# EAGLE schematic LinTempCont_4ch_V1_1 (EAGLE 6.5.0)

## Sheet 1 of 5: Digital and DAC
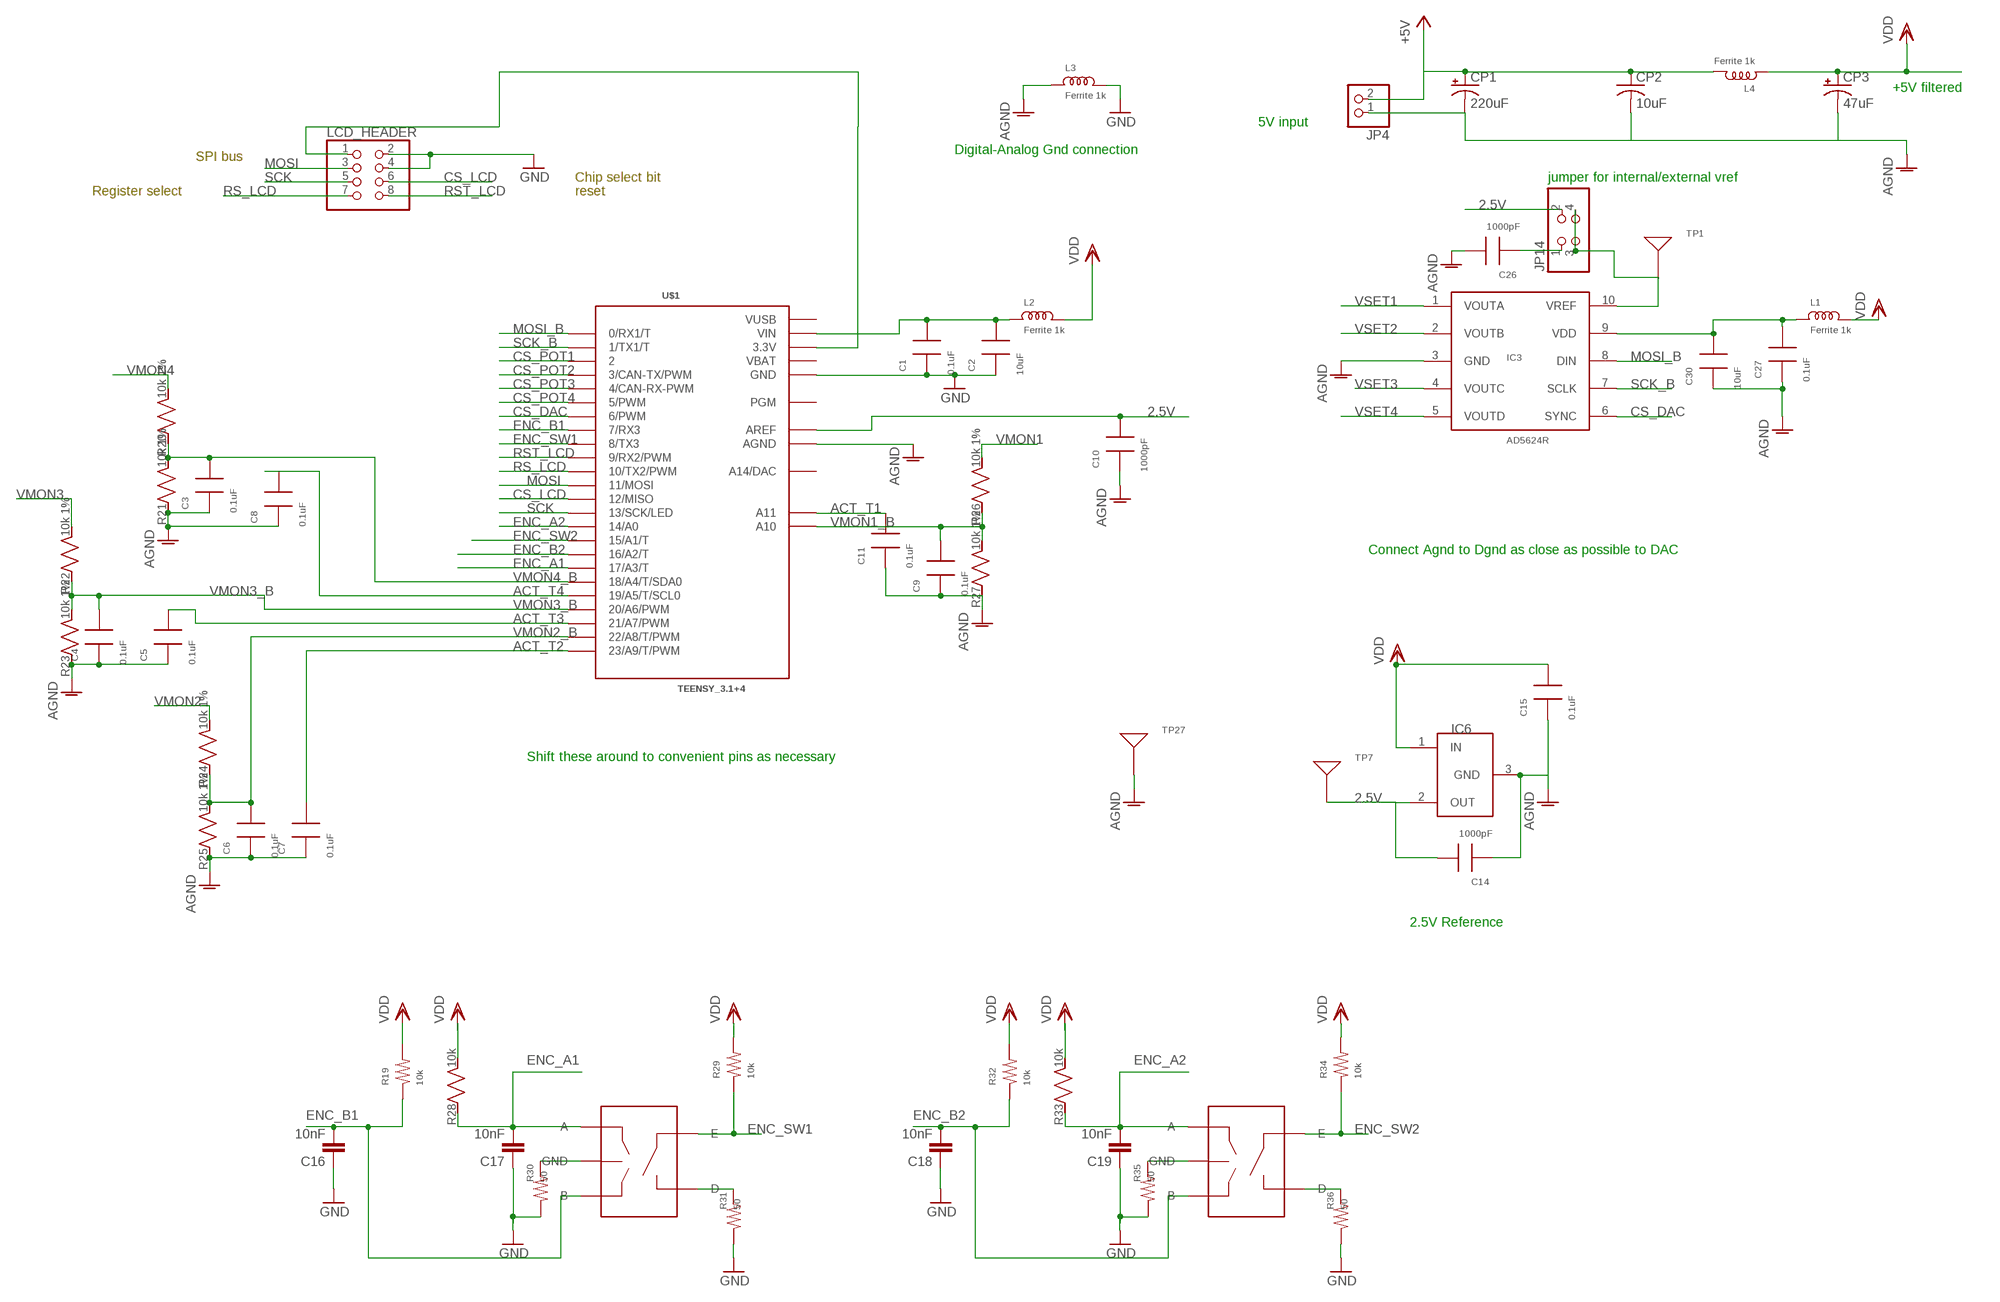
[diagram p0: schematic, sheet 1]

### Parts
C1  0.1uF  CAP0603  [0603]
C2  10uF  CAP0805  [0805]
C3  0.1uF  CAP0603  [0603]
C4  0.1uF  CAP0603  [0603]
C5  0.1uF  CAP0603  [0603]
C6  0.1uF  CAP0603  [0603]
C7  0.1uF  CAP0603  [0603]
C8  0.1uF  CAP0603  [0603]
C9  0.1uF  CAP0603  [0603]
C10  1000pF  CAP0603  [0603]
C11  0.1uF  CAP0603  [0603]
C14  1000pF  CAP0603  [0603]
C15  0.1uF  CAP0603  [0603]
C16  10nF  C-EUC0603  [C0603]
C17  10nF  C-EUC0603  [C0603]
C18  10nF  C-EUC0603  [C0603]
C19  10nF  C-EUC0603  [C0603]
C26  1000pF  CAP0603  [0603]
C27  0.1uF  CAP0603  [0603]
C30  10uF  CAP0805  [0805]
CP1  220uF  CPOL-USF  [PANASONIC_F]
CP2  10uF  C-USC0805K  [C0805K]
CP3  47uF  CPOL-USCT7343  [CT7343]
ENC1  PEC09  [PEC092320FS]
ENC2  PEC09  [PEC092320FS]
IC3  AD5624R  [MSOP10]
IC6  TS6001  [SOT-23]
JP4  SCRWTRM-1X2  [1X02_SCRWTRM]
JP14  PINHD-2X2  [2X02]
L1  Ferrite 1k  INDUCTOR-0805  [0805]
L2  Ferrite 1k  INDUCTOR-0805  [0805]
L3  Ferrite 1k  INDUCTOR-0805  [0805]
L4  Ferrite 1k  INDUCTOR-0805  [0805]
LCD_HEADER  PINHD-2X4-SHROUD  [ML08]
R19  10k  RES0603  [0603]
R20  10k 1%  R_SMDR0603  [R_0603]
R21  10k 1%  R_SMDR0603  [R_0603]
R22  10k 1%  R_SMDR0603  [R_0603]
R23  10k 1%  R_SMDR0603  [R_0603]
R24  10k 1%  R_SMDR0603  [R_0603]
R25  10k 1%  R_SMDR0603  [R_0603]
R26  10k 1%  R_SMDR0603  [R_0603]
R27  10k 1%  R_SMDR0603  [R_0603]
R28  10k  R_SMDR0603  [R_0603]
R29  10k  RES0603  [0603]
R30  50  RES0603  [0603]
R31  50  RES0603  [0603]
R32  10k  RES0603  [0603]
R33  10k  R_SMDR0603  [R_0603]
R34  10k  RES0603  [0603]
R35  50  RES0603  [0603]
R36  50  RES0603  [0603]
TP1  TESTPT  [1206TESTPAD]
TP7  TESTPT  [1206TESTPAD]
TP27  TESTPT  [1206TESTPAD]
U$1  TEENSY_3.1+4  [TEENSY_3.1+4]

### Nets
2.5V: C10.2 C14.2 IC6.2(OUT) JP14.2 TP7.P$1 U$1.AREF ; also sheet 2,3,4,5
3.3V: LCD_HEADER.1 U$1.3.3V U$1.3.3V1(3.3V)
+5V: CP1.+ CP2.1 JP4.2 L4.2
ACT_T1: C11.2 U$1.A11 ; also sheet 2
ACT_T2: C7.2 U$1.23/A9(23/A9/T/PWM) ; also sheet 3
ACT_T3: C5.2 U$1.21/A7(21/A7/PWM) ; also sheet 4
ACT_T4: C8.2 U$1.19/A5(19/A5/T/SCL0) ; also sheet 5
AGND: C3.1 C4.1 C5.1 C6.1 C7.1 C8.1 C9.1 C10.1 C11.1 C14.1 C15.1 C26.2 C27.1 C30.1 CP1.- CP2.2 CP3.- IC3.3(GND) IC6.3(GND) JP4.1 L3.1 R21.P$1 R23.P$1 R25.P$1 R27.P$1 TP27.P$1 U$1.AGND ; also sheet 2,3,4,5
CS_DAC: IC3.6(SYNC) U$1.6(6/PWM)
CS_LCD: LCD_HEADER.6 U$1.12(12/MISO)
CS_POT1: U$1.2 ; also sheet 2
CS_POT2: U$1.3(3/CAN-TX/PWM) ; also sheet 3
CS_POT3: U$1.4(4/CAN-RX-PWM) ; also sheet 4
CS_POT4: U$1.5(5/PWM) ; also sheet 5
DGND: C1.1 C2.1 C16.1 C17.1 C18.1 C19.1 L3.2 LCD_HEADER.2 LCD_HEADER.4 R30.1 R31.1 R35.1 R36.1 U$1.GND U$1.GND1(GND) ; supply symbol labelled GND ; also sheet 2,3,4,5
ENC_A1: C17.2 ENC1.A R28.P$1 U$1.17/A3(17/A3/T)
ENC_A2: C19.2 ENC2.A R33.P$1 U$1.14/A0
ENC_B1: C16.2 ENC1.B R19.1 U$1.7(7/RX3)
ENC_B2: C18.2 ENC2.B R32.1 U$1.16/A2(16/A2/T)
ENC_SW1: ENC1.E R29.1 U$1.8(8/TX3)
ENC_SW2: ENC2.E R34.1 U$1.15/A1(15/A1/T)
MOSI: LCD_HEADER.3 U$1.11(11/MOSI)
MOSI_B: IC3.8(DIN) U$1.0(0/RX1/T) ; also sheet 2,3,4,5
N$1: IC3.10(VREF) JP14.3 JP14.4 TP1.P$1
N$15: ENC1.C(GND) R30.2
N$16: ENC1.D R31.2
N$17: ENC2.C(GND) R35.2
N$18: C26.1 JP14.1
N$19: ENC2.D R36.2
N$24: C27.2 C30.2 IC3.9(VDD) L1.1
N$25: C1.2 C2.2 L2.1 U$1.VIN
RS_LCD: LCD_HEADER.7 U$1.10(10/TX2/PWM)
RST_LCD: LCD_HEADER.8 U$1.9(9/RX2/PWM)
SCK: LCD_HEADER.5 U$1.13(13/SCK/LED)
SCK_B: IC3.7(SCLK) U$1.1(1/TX1/T) ; also sheet 2,3,4,5
VDD: C15.2 CP3.+ IC6.1(IN) L1.2 L2.2 L4.1 R19.2 R28.P$2 R29.2 R32.2 R33.P$2 R34.2 ; also sheet 2,3,4,5
VMON1: R26.P$2 ; also sheet 2
VMON1_B: C9.2 R26.P$1 R27.P$2 U$1.A10
VMON2: R24.P$2 ; also sheet 3
VMON2_B: C6.2 R24.P$1 R25.P$2 U$1.22/A8(22/A8/T/PWM)
VMON3: R22.P$2 ; also sheet 4
VMON3_B: C4.2 R22.P$1 R23.P$2 U$1.20/A6(20/A6/PWM)
VMON4: R20.P$2 ; also sheet 5
VMON4_B: C3.2 R20.P$1 R21.P$2 U$1.18/A4(18/A4/T/SDA0)
VSET1: IC3.1(VOUTA) ; also sheet 2
VSET2: IC3.2(VOUTB) ; also sheet 3
VSET3: IC3.4(VOUTC) ; also sheet 4
VSET4: IC3.5(VOUTD) ; also sheet 5
Unconnected: U$1.A14(A14/DAC) U$1.PGM

### Notes on the sheet
- +5V filtered
- 5V input
- Digital-Analog Gnd connection
- SPI bus
- Chip select bit | jumper for internal/external vref
- Register select | reset
- Connect Agnd to Dgnd as close as possible to DAC
- Shift these around to convenient pins as necessary
- 2.5V Reference

## Sheet 2 of 5: Ch1
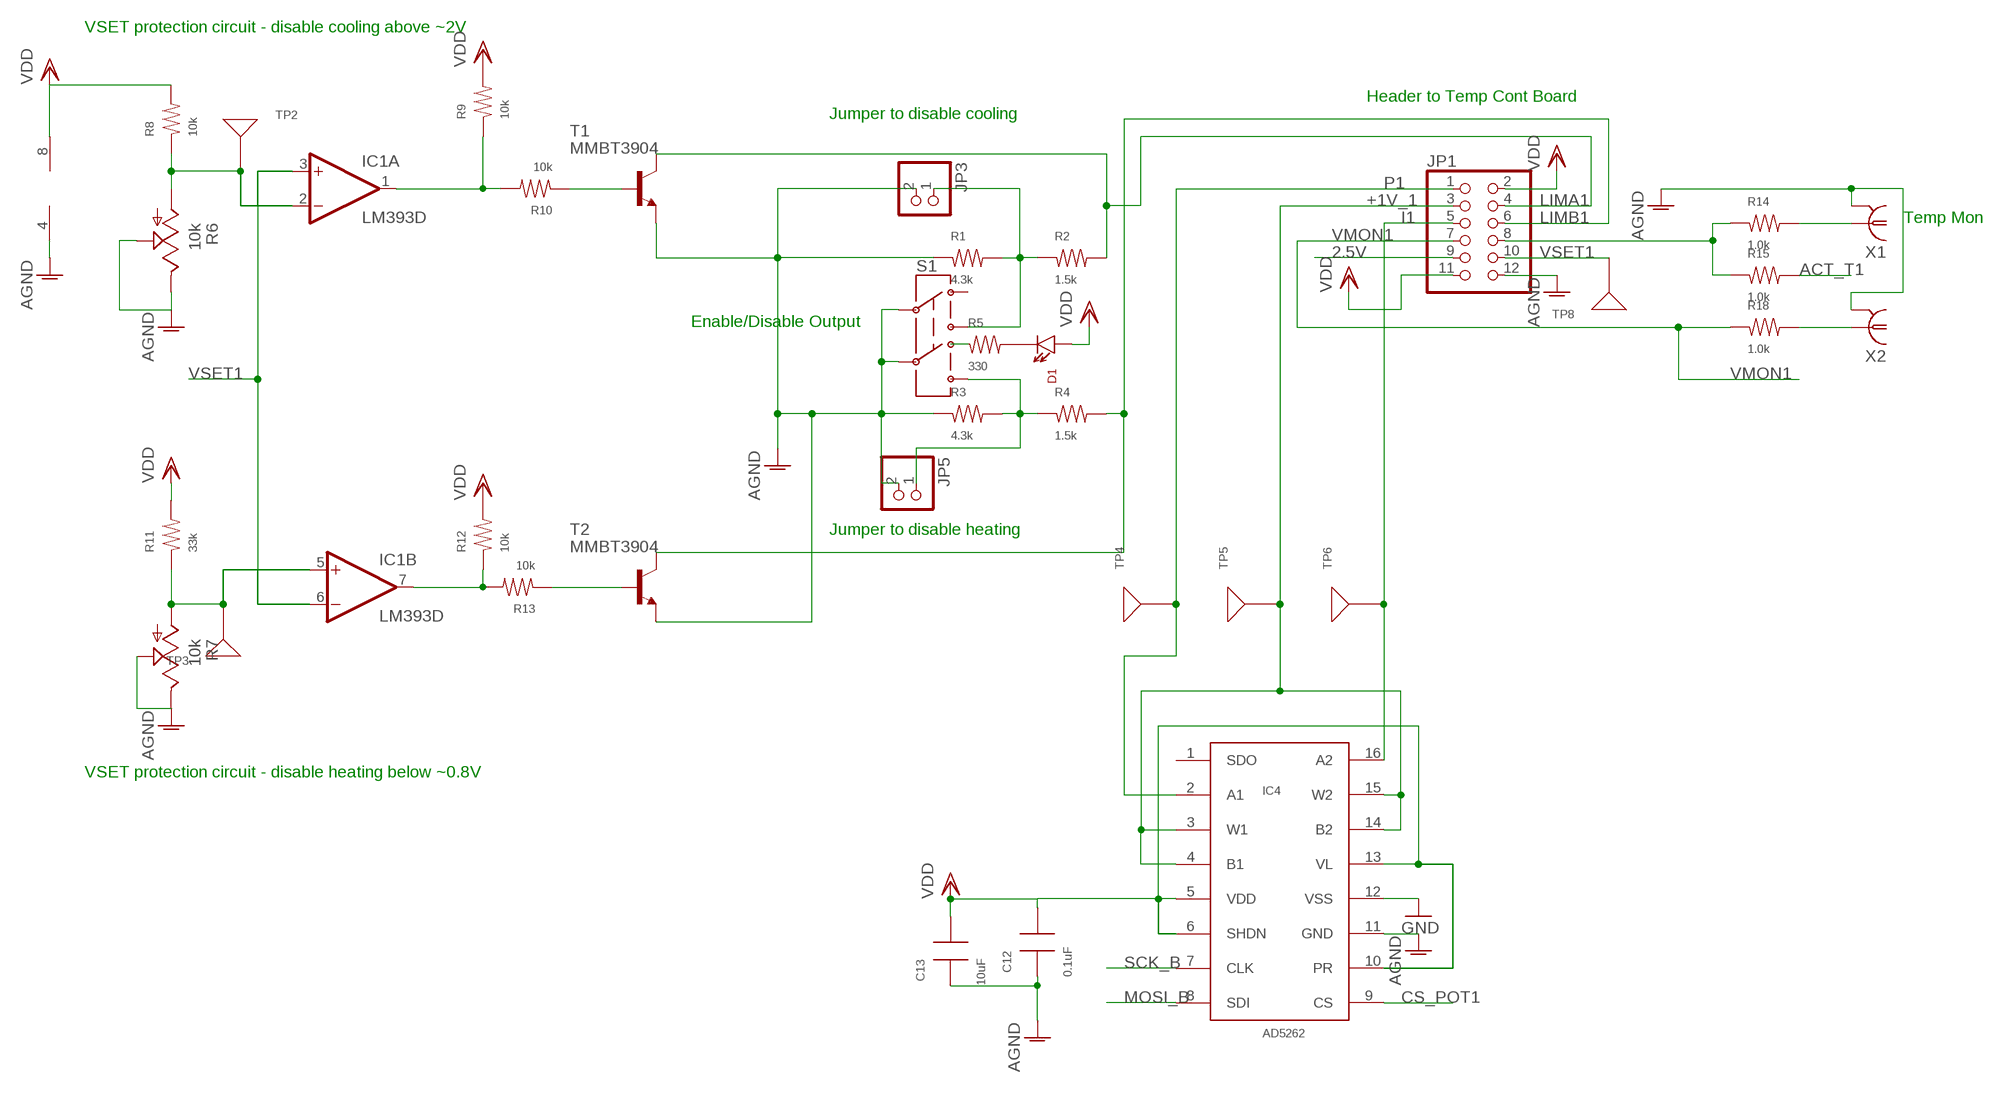
[diagram p1: schematic, sheet 2]

### Parts
C12  0.1uF  CAP0603  [0603]
C13  10uF  CAP0805  [0805]
D1  LED/MINI-IND  [HLMP--F0010]
IC1  LM393D  [SO08]
IC4  AD5262  [TSSOP16]
JP1  PINHD-2X6/90  [2X06/90]
JP3  PINHD-1X2  [1X02]
JP5  PINHD-1X2  [1X02]
R1  4.3k  RES0603  [0603]
R2  1.5k  RES0603  [0603]
R3  4.3k  RES0603  [0603]
R4  1.5k  RES0603  [0603]
R5  330  RES0603  [0603]
R6  10k  MODEL64_TRIMPOT/TOP-ADJ  [64WPOT]
R7  10k  MODEL64_TRIMPOT/TOP-ADJ  [64WPOT]
R8  10k  RES0603  [0603]
R9  10k  RES0603  [0603]
R10  10k  RES0603  [0603]
R11  33k  RES0603  [0603]
R12  10k  RES0603  [0603]
R13  10k  RES0603  [0603]
R14  1.0k  RES0603  [0603]
R15  1.0k  RES0603  [0603]
R18  1.0k  RES0603  [0603]
S1  SWITCH-DPDT/VER  [E-SWITCH-100-M7]
T1  MMBT3904  [SOT-23]
T2  MMBT3904  [SOT-23]
TP2  TESTPT  [1206TESTPAD]
TP3  TESTPT  [1206TESTPAD]
TP4  TESTPT  [1206TESTPAD]
TP5  TESTPT  [1206TESTPAD]
TP6  TESTPT  [1206TESTPAD]
TP8  TESTPT  [1206TESTPAD]
X1  BNC-H  [BNC90]
X2  BNC-H  [BNC90]

### Nets
2.5V: JP1.9 ; also sheet 1,3,4,5
+1V_1: IC4.3(W1) IC4.4(B1) IC4.14(B2) IC4.15(W2) JP1.3 TP5.P$1
ACT_T1: R15.2 ; also sheet 1
AGND: C12.1 C13.1 IC1.4(P:V-) IC4.11(GND) JP1.12 JP3.2 JP5.2 R1.1 R3.1 R6.P$2 R6.P$3 R7.P$2 R7.P$3 S1.P$2 S1.P$5 T1.2(E) T2.2(E) X1.2 X2.2 ; also sheet 1,3,4,5
CS_POT1: IC4.9(CS) ; also sheet 1
DGND: IC4.12(VSS) ; supply symbol labelled GND ; also sheet 1,3,4,5
I1: IC4.16(A2) JP1.5 TP6.P$1
LIMA1: JP1.4 R2.2 T1.3(C)
LIMB1: JP1.6 R4.2 T2.3(C)
MOSI_B: IC4.8(SDI) ; also sheet 1,3,4,5
N$3: JP3.1 R1.2 R2.1 S1.P$3
N$4: R14.2 X1.1
N$5: JP5.1 R3.2 R4.1 S1.P$6
N$6: IC1.2(A:-IN) R6.P$1 R8.1 TP2.P$1
N$7: IC1.5(B:+IN) R7.P$1 R11.1 TP3.P$1
N$8: IC1.7(B:OUT) R12.1 R13.2
N$9: IC1.1(A:OUT) R9.1 R10.2
N$10: R10.1 T1.1(B)
N$11: R13.1 T2.1(B)
N$12: D1.C R5.2
N$13: R5.1 S1.P$4
N$14: R18.2 X2.1
N$69: JP1.8 R14.1 R15.1
P1: IC4.2(A1) JP1.1 TP4.P$1
SCK_B: IC4.7(CLK) ; also sheet 1,3,4,5
VDD: C12.2 C13.2 D1.A IC1.8(P:V+) IC4.5(VDD) IC4.6(SHDN) IC4.10(PR) IC4.13(VL) JP1.2 JP1.11 R8.2 R9.2 R11.2 R12.2 ; also sheet 1,3,4,5
VMON1: JP1.7 R18.1 ; also sheet 1
VSET1: IC1.3(A:+IN) IC1.6(B:-IN) JP1.10 TP8.P$1 ; also sheet 1
Unconnected: IC4.1(SDO) S1.P$1

### Notes on the sheet
- VSET protection circuit - disable cooling above ~2V
- Header to Temp Cont Board
- Jumper to disable cooling
- Temp Mon
- Enable/Disable Output
- Jumper to disable heating
- VSET protection circuit - disable heating below ~0.8V

## Sheet 3 of 5: Ch2
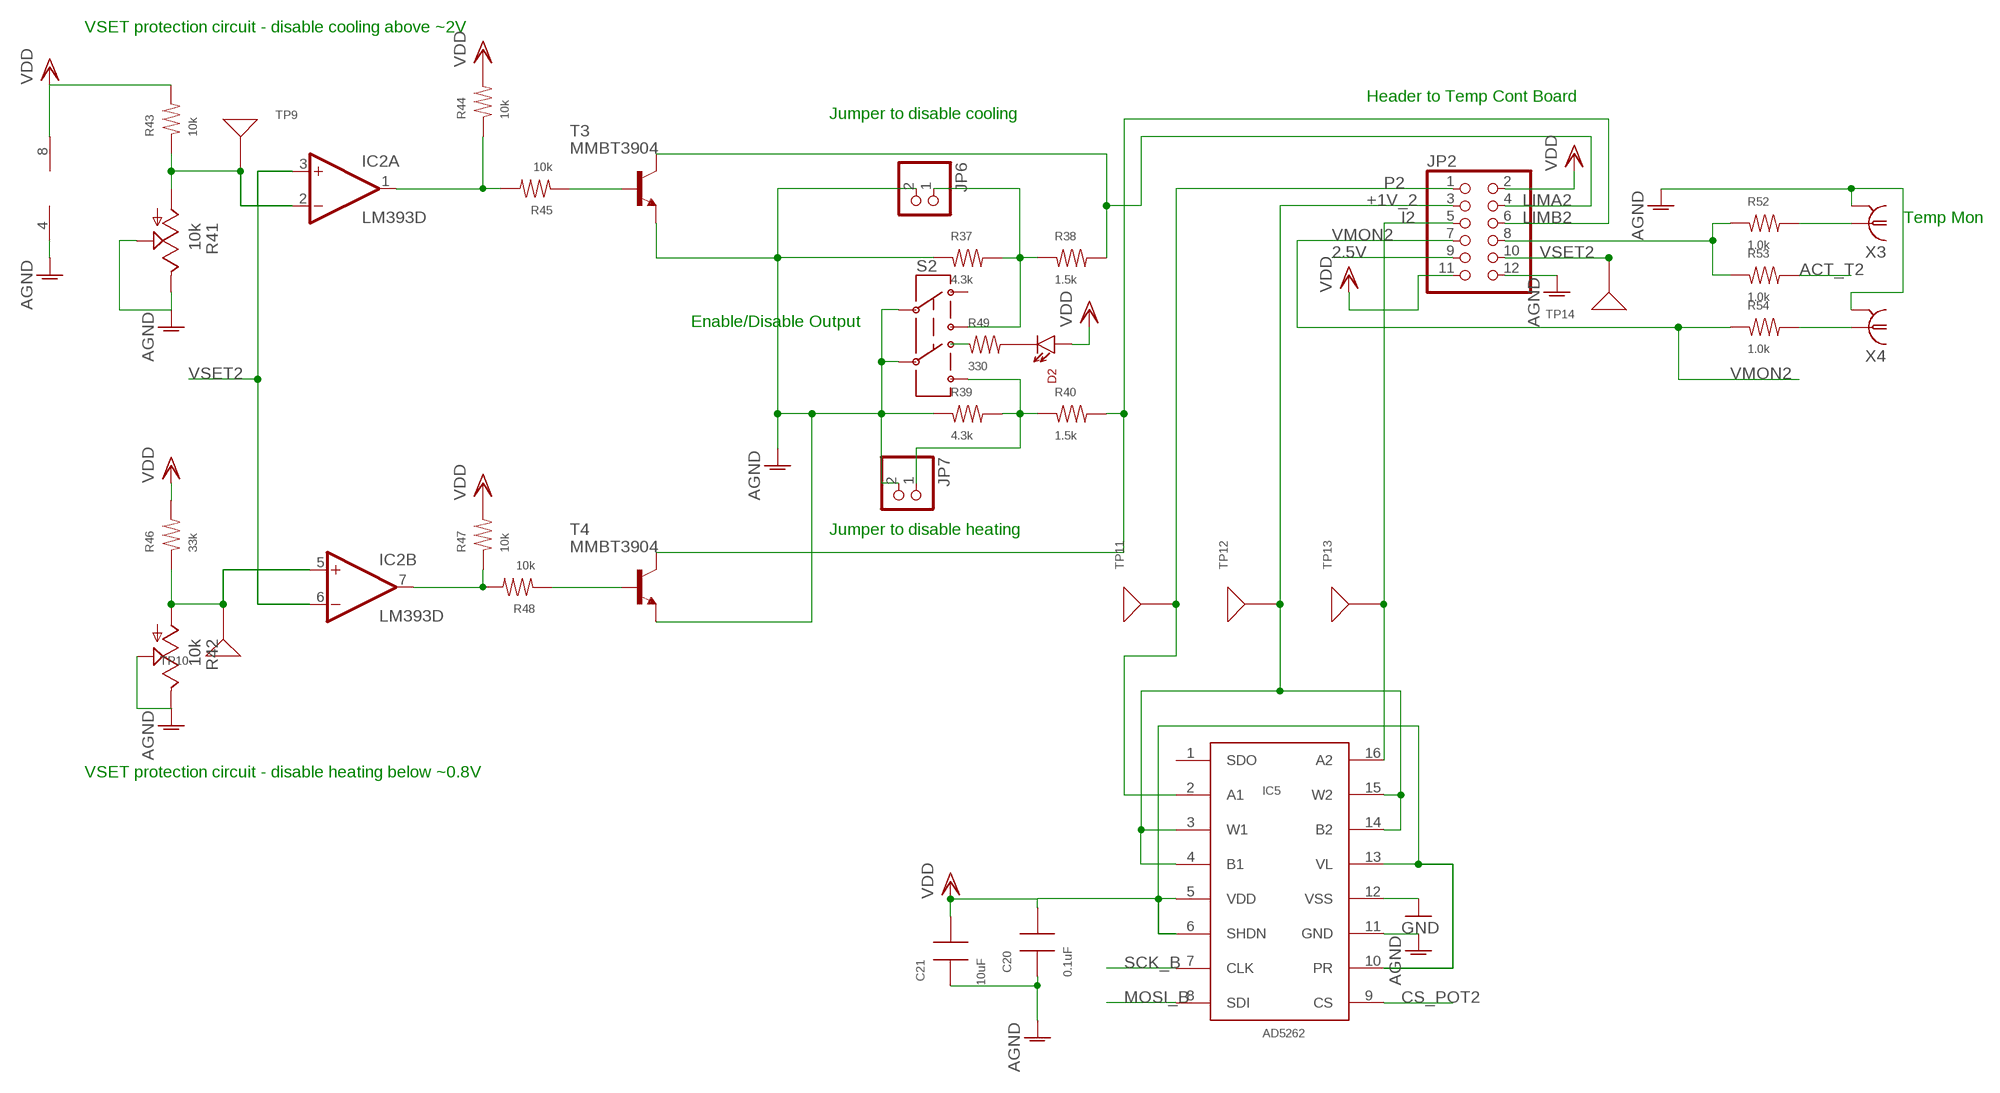
[diagram p2: schematic, sheet 3]

### Parts
C20  0.1uF  CAP0603  [0603]
C21  10uF  CAP0805  [0805]
D2  LED/MINI-IND  [HLMP--F0010]
IC2  LM393D  [SO08]
IC5  AD5262  [TSSOP16]
JP2  PINHD-2X6/90  [2X06/90]
JP6  PINHD-1X2  [1X02]
JP7  PINHD-1X2  [1X02]
R37  4.3k  RES0603  [0603]
R38  1.5k  RES0603  [0603]
R39  4.3k  RES0603  [0603]
R40  1.5k  RES0603  [0603]
R41  10k  MODEL64_TRIMPOT/TOP-ADJ  [64WPOT]
R42  10k  MODEL64_TRIMPOT/TOP-ADJ  [64WPOT]
R43  10k  RES0603  [0603]
R44  10k  RES0603  [0603]
R45  10k  RES0603  [0603]
R46  33k  RES0603  [0603]
R47  10k  RES0603  [0603]
R48  10k  RES0603  [0603]
R49  330  RES0603  [0603]
R52  1.0k  RES0603  [0603]
R53  1.0k  RES0603  [0603]
R54  1.0k  RES0603  [0603]
S2  SWITCH-DPDT/VER  [E-SWITCH-100-M7]
T3  MMBT3904  [SOT-23]
T4  MMBT3904  [SOT-23]
TP9  TESTPT  [1206TESTPAD]
TP10  TESTPT  [1206TESTPAD]
TP11  TESTPT  [1206TESTPAD]
TP12  TESTPT  [1206TESTPAD]
TP13  TESTPT  [1206TESTPAD]
TP14  TESTPT  [1206TESTPAD]
X3  BNC-H  [BNC90]
X4  BNC-H  [BNC90]

### Nets
2.5V: JP2.9 ; also sheet 1,2,4,5
+1V_2: IC5.3(W1) IC5.4(B1) IC5.14(B2) IC5.15(W2) JP2.3 TP12.P$1
ACT_T2: R53.2 ; also sheet 1
AGND: C20.1 C21.1 IC2.4(P:V-) IC5.11(GND) JP2.12 JP6.2 JP7.2 R37.1 R39.1 R41.P$2 R41.P$3 R42.P$2 R42.P$3 S2.P$2 S2.P$5 T3.2(E) T4.2(E) X3.2 X4.2 ; also sheet 1,2,4,5
CS_POT2: IC5.9(CS) ; also sheet 1
DGND: IC5.12(VSS) ; supply symbol labelled GND ; also sheet 1,2,4,5
I2: IC5.16(A2) JP2.5 TP13.P$1
LIMA2: JP2.4 R38.2 T3.3(C)
LIMB2: JP2.6 R40.2 T4.3(C)
MOSI_B: IC5.8(SDI) ; also sheet 1,2,4,5
N$21: JP6.1 R37.2 R38.1 S2.P$3
N$22: JP7.1 R39.2 R40.1 S2.P$6
N$23: IC2.2(A:-IN) R41.P$1 R43.1 TP9.P$1
N$26: IC2.1(A:OUT) R44.1 R45.2
N$27: R45.1 T3.1(B)
N$28: IC2.5(B:+IN) R42.P$1 R46.1 TP10.P$1
N$29: IC2.7(B:OUT) R47.1 R48.2
N$30: R48.1 T4.1(B)
N$31: D2.C R49.2
N$32: R49.1 S2.P$4
N$35: JP2.8 R52.1 R53.1
N$36: R52.2 X3.1
N$37: R54.2 X4.1
P2: IC5.2(A1) JP2.1 TP11.P$1
SCK_B: IC5.7(CLK) ; also sheet 1,2,4,5
VDD: C20.2 C21.2 D2.A IC2.8(P:V+) IC5.5(VDD) IC5.6(SHDN) IC5.10(PR) IC5.13(VL) JP2.2 JP2.11 R43.2 R44.2 R46.2 R47.2 ; also sheet 1,2,4,5
VMON2: JP2.7 R54.1 ; also sheet 1
VSET2: IC2.3(A:+IN) IC2.6(B:-IN) JP2.10 TP14.P$1 ; also sheet 1
Unconnected: IC5.1(SDO) S2.P$1

### Notes on the sheet
- VSET protection circuit - disable cooling above ~2V
- Header to Temp Cont Board
- Jumper to disable cooling
- Temp Mon
- Enable/Disable Output
- Jumper to disable heating
- VSET protection circuit - disable heating below ~0.8V

## Sheet 4 of 5: Ch3
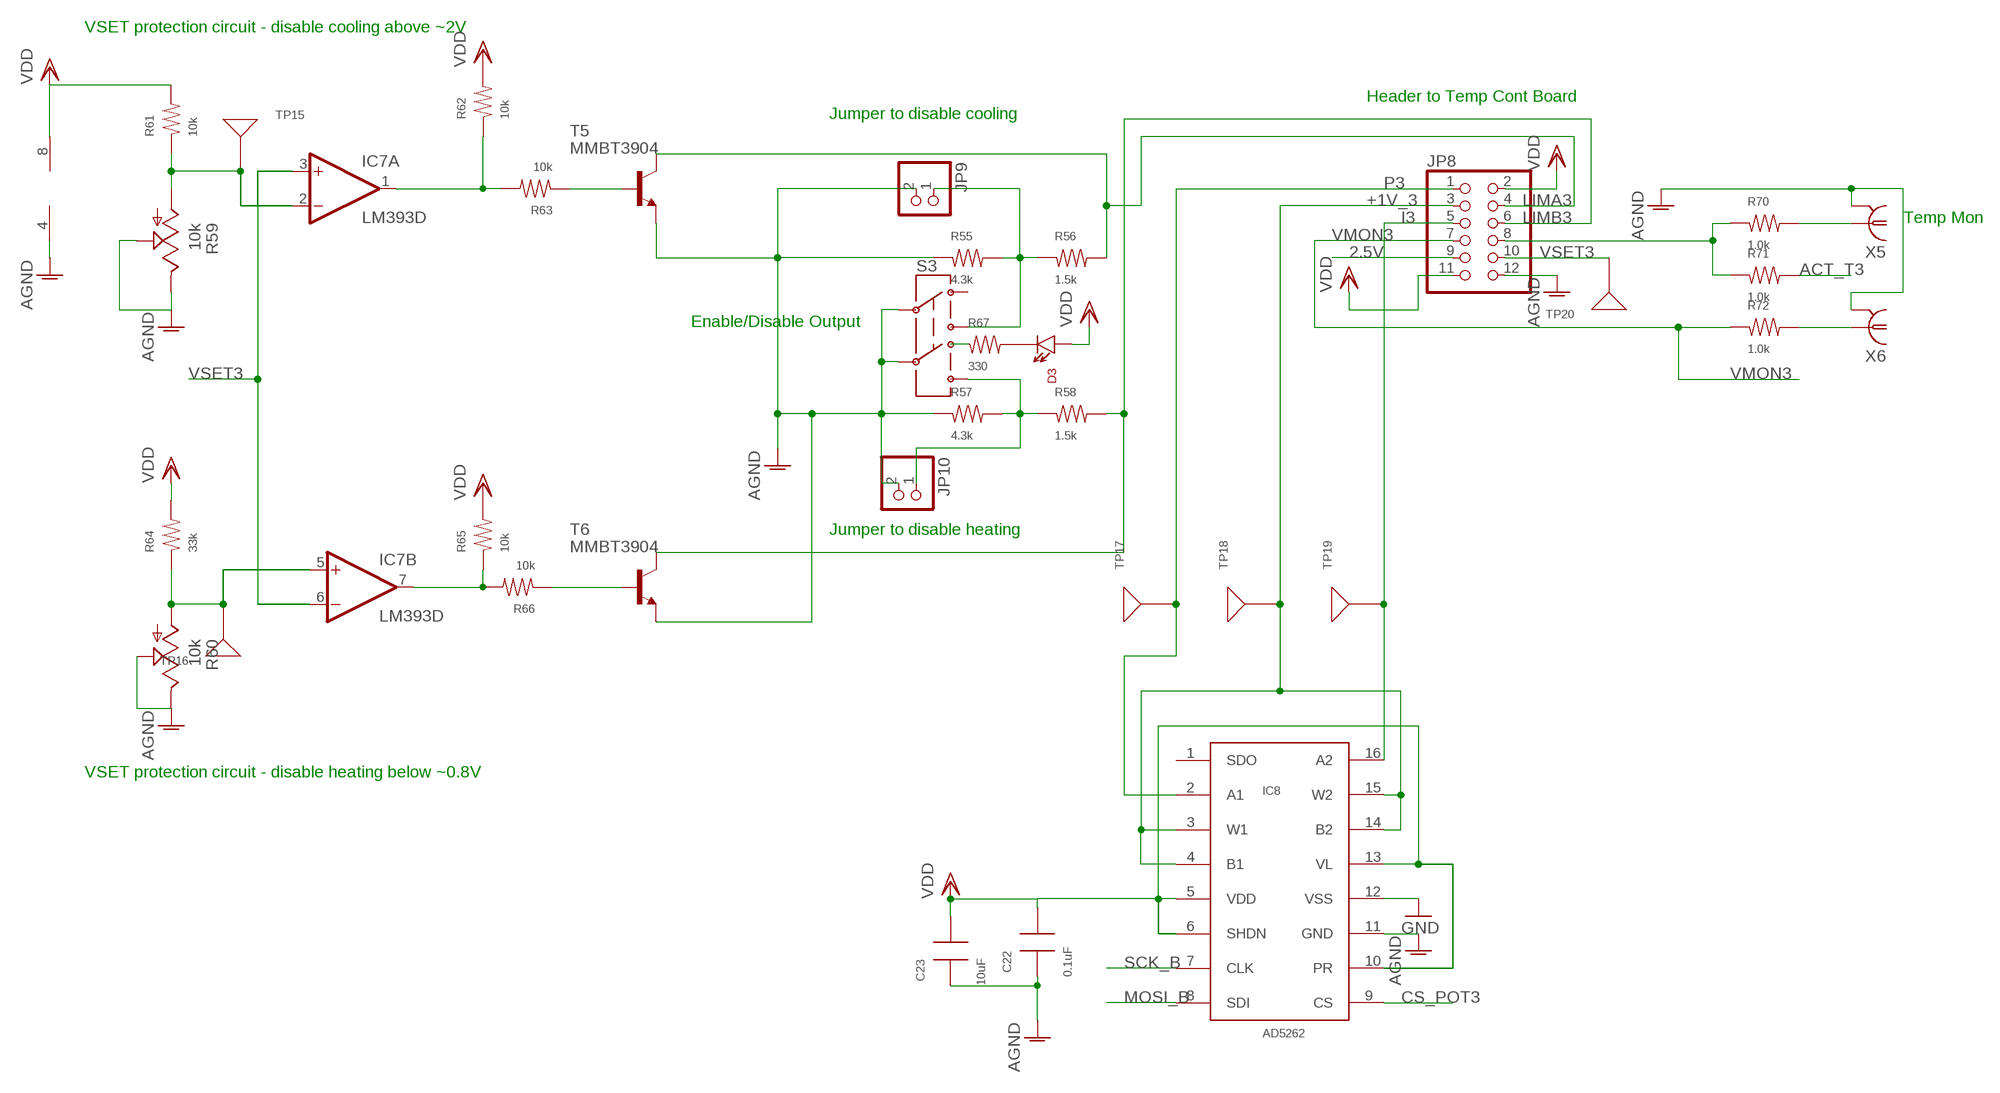
[diagram p3: schematic, sheet 4]

### Parts
C22  0.1uF  CAP0603  [0603]
C23  10uF  CAP0805  [0805]
D3  LED/MINI-IND  [HLMP--F0010]
IC7  LM393D  [SO08]
IC8  AD5262  [TSSOP16]
JP8  PINHD-2X6/90  [2X06/90]
JP9  PINHD-1X2  [1X02]
JP10  PINHD-1X2  [1X02]
R55  4.3k  RES0603  [0603]
R56  1.5k  RES0603  [0603]
R57  4.3k  RES0603  [0603]
R58  1.5k  RES0603  [0603]
R59  10k  MODEL64_TRIMPOT/TOP-ADJ  [64WPOT]
R60  10k  MODEL64_TRIMPOT/TOP-ADJ  [64WPOT]
R61  10k  RES0603  [0603]
R62  10k  RES0603  [0603]
R63  10k  RES0603  [0603]
R64  33k  RES0603  [0603]
R65  10k  RES0603  [0603]
R66  10k  RES0603  [0603]
R67  330  RES0603  [0603]
R70  1.0k  RES0603  [0603]
R71  1.0k  RES0603  [0603]
R72  1.0k  RES0603  [0603]
S3  SWITCH-DPDT/VER  [E-SWITCH-100-M7]
T5  MMBT3904  [SOT-23]
T6  MMBT3904  [SOT-23]
TP15  TESTPT  [1206TESTPAD]
TP16  TESTPT  [1206TESTPAD]
TP17  TESTPT  [1206TESTPAD]
TP18  TESTPT  [1206TESTPAD]
TP19  TESTPT  [1206TESTPAD]
TP20  TESTPT  [1206TESTPAD]
X5  BNC-H  [BNC90]
X6  BNC-H  [BNC90]

### Nets
2.5V: JP8.9 ; also sheet 1,2,3,5
+1V_3: IC8.3(W1) IC8.4(B1) IC8.14(B2) IC8.15(W2) JP8.3 TP18.P$1
ACT_T3: R71.2 ; also sheet 1
AGND: C22.1 C23.1 IC7.4(P:V-) IC8.11(GND) JP8.12 JP9.2 JP10.2 R55.1 R57.1 R59.P$2 R59.P$3 R60.P$2 R60.P$3 S3.P$2 S3.P$5 T5.2(E) T6.2(E) X5.2 X6.2 ; also sheet 1,2,3,5
CS_POT3: IC8.9(CS) ; also sheet 1
DGND: IC8.12(VSS) ; supply symbol labelled GND ; also sheet 1,2,3,5
I3: IC8.16(A2) JP8.5 TP19.P$1
LIMA3: JP8.4 R56.2 T5.3(C)
LIMB3: JP8.6 R58.2 T6.3(C)
MOSI_B: IC8.8(SDI) ; also sheet 1,2,3,5
N$38: JP9.1 R55.2 R56.1 S3.P$3
N$39: JP10.1 R57.2 R58.1 S3.P$6
N$40: IC7.2(A:-IN) R59.P$1 R61.1 TP15.P$1
N$41: IC7.1(A:OUT) R62.1 R63.2
N$42: R63.1 T5.1(B)
N$43: IC7.5(B:+IN) R60.P$1 R64.1 TP16.P$1
N$44: IC7.7(B:OUT) R65.1 R66.2
N$45: R66.1 T6.1(B)
N$46: D3.C R67.2
N$47: R67.1 S3.P$4
N$50: JP8.8 R70.1 R71.1
N$51: R70.2 X5.1
N$52: R72.2 X6.1
P3: IC8.2(A1) JP8.1 TP17.P$1
SCK_B: IC8.7(CLK) ; also sheet 1,2,3,5
VDD: C22.2 C23.2 D3.A IC7.8(P:V+) IC8.5(VDD) IC8.6(SHDN) IC8.10(PR) IC8.13(VL) JP8.2 JP8.11 R61.2 R62.2 R64.2 R65.2 ; also sheet 1,2,3,5
VMON3: JP8.7 R72.1 ; also sheet 1
VSET3: IC7.3(A:+IN) IC7.6(B:-IN) JP8.10 TP20.P$1 ; also sheet 1
Unconnected: IC8.1(SDO) S3.P$1

### Notes on the sheet
- VSET protection circuit - disable cooling above ~2V
- Header to Temp Cont Board
- Jumper to disable cooling
- Temp Mon
- Enable/Disable Output
- Jumper to disable heating
- VSET protection circuit - disable heating below ~0.8V

## Sheet 5 of 5: Ch4
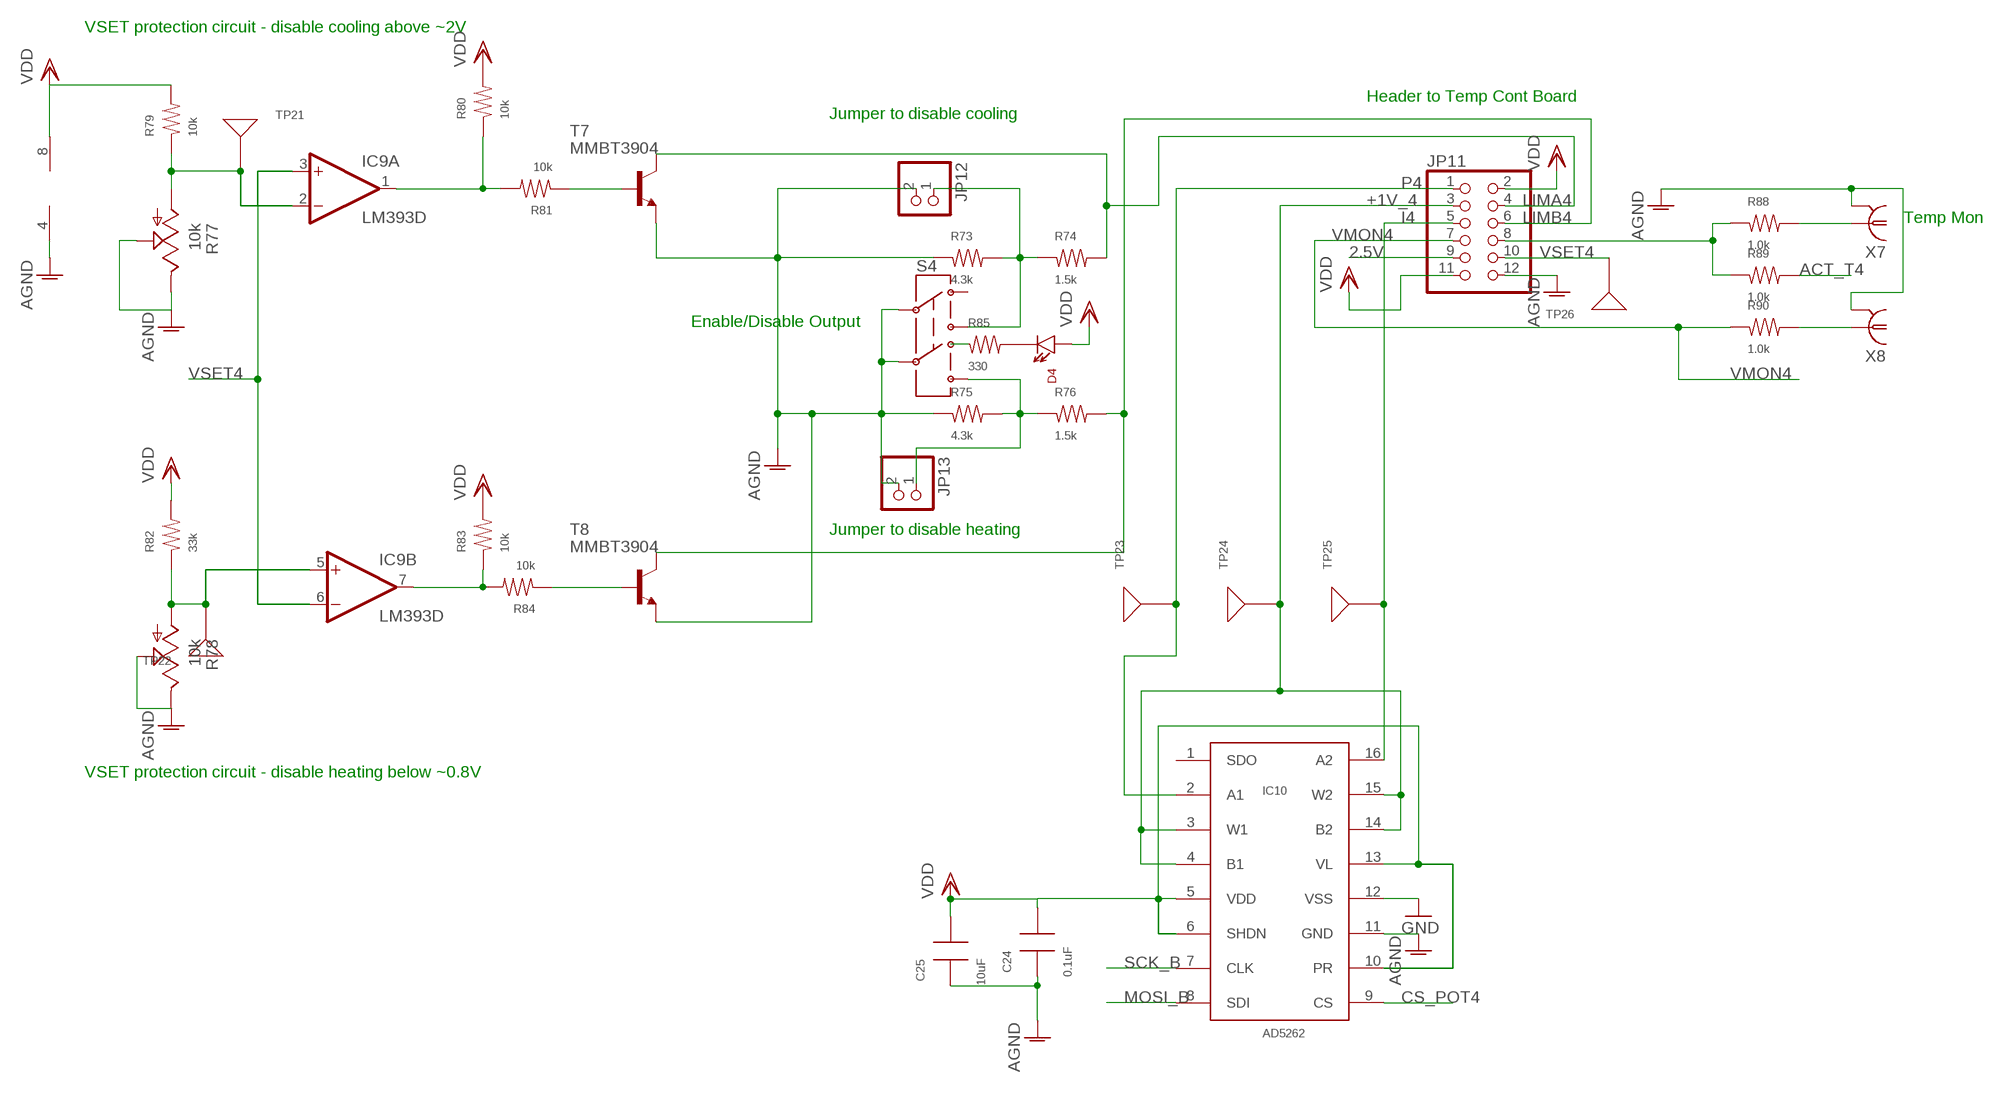
[diagram p4: schematic, sheet 5]

### Parts
C24  0.1uF  CAP0603  [0603]
C25  10uF  CAP0805  [0805]
D4  LED/MINI-IND  [HLMP--F0010]
IC9  LM393D  [SO08]
IC10  AD5262  [TSSOP16]
JP11  PINHD-2X6/90  [2X06/90]
JP12  PINHD-1X2  [1X02]
JP13  PINHD-1X2  [1X02]
R73  4.3k  RES0603  [0603]
R74  1.5k  RES0603  [0603]
R75  4.3k  RES0603  [0603]
R76  1.5k  RES0603  [0603]
R77  10k  MODEL64_TRIMPOT/TOP-ADJ  [64WPOT]
R78  10k  MODEL64_TRIMPOT/TOP-ADJ  [64WPOT]
R79  10k  RES0603  [0603]
R80  10k  RES0603  [0603]
R81  10k  RES0603  [0603]
R82  33k  RES0603  [0603]
R83  10k  RES0603  [0603]
R84  10k  RES0603  [0603]
R85  330  RES0603  [0603]
R88  1.0k  RES0603  [0603]
R89  1.0k  RES0603  [0603]
R90  1.0k  RES0603  [0603]
S4  SWITCH-DPDT/VER  [E-SWITCH-100-M7]
T7  MMBT3904  [SOT-23]
T8  MMBT3904  [SOT-23]
TP21  TESTPT  [1206TESTPAD]
TP22  TESTPT  [1206TESTPAD]
TP23  TESTPT  [1206TESTPAD]
TP24  TESTPT  [1206TESTPAD]
TP25  TESTPT  [1206TESTPAD]
TP26  TESTPT  [1206TESTPAD]
X7  BNC-H  [BNC90]
X8  BNC-H  [BNC90]

### Nets
2.5V: JP11.9 ; also sheet 1,2,3,4
+1V_4: IC10.3(W1) IC10.4(B1) IC10.14(B2) IC10.15(W2) JP11.3 TP24.P$1
ACT_T4: R89.2 ; also sheet 1
AGND: C24.1 C25.1 IC9.4(P:V-) IC10.11(GND) JP11.12 JP12.2 JP13.2 R73.1 R75.1 R77.P$2 R77.P$3 R78.P$2 R78.P$3 S4.P$2 S4.P$5 T7.2(E) T8.2(E) X7.2 X8.2 ; also sheet 1,2,3,4
CS_POT4: IC10.9(CS) ; also sheet 1
DGND: IC10.12(VSS) ; supply symbol labelled GND ; also sheet 1,2,3,4
I4: IC10.16(A2) JP11.5 TP25.P$1
LIMA4: JP11.4 R74.2 T7.3(C)
LIMB4: JP11.6 R76.2 T8.3(C)
MOSI_B: IC10.8(SDI) ; also sheet 1,2,3,4
N$53: JP12.1 R73.2 R74.1 S4.P$3
N$54: JP13.1 R75.2 R76.1 S4.P$6
N$55: IC9.2(A:-IN) R77.P$1 R79.1 TP21.P$1
N$56: IC9.1(A:OUT) R80.1 R81.2
N$57: R81.1 T7.1(B)
N$58: IC9.5(B:+IN) R78.P$1 R82.1 TP22.P$1
N$59: IC9.7(B:OUT) R83.1 R84.2
N$60: R84.1 T8.1(B)
N$61: D4.C R85.2
N$62: R85.1 S4.P$4
N$65: JP11.8 R88.1 R89.1
N$66: R88.2 X7.1
N$67: R90.2 X8.1
P4: IC10.2(A1) JP11.1 TP23.P$1
SCK_B: IC10.7(CLK) ; also sheet 1,2,3,4
VDD: C24.2 C25.2 D4.A IC9.8(P:V+) IC10.5(VDD) IC10.6(SHDN) IC10.10(PR) IC10.13(VL) JP11.2 JP11.11 R79.2 R80.2 R82.2 R83.2 ; also sheet 1,2,3,4
VMON4: JP11.7 R90.1 ; also sheet 1
VSET4: IC9.3(A:+IN) IC9.6(B:-IN) JP11.10 TP26.P$1 ; also sheet 1
Unconnected: IC10.1(SDO) S4.P$1

### Notes on the sheet
- VSET protection circuit - disable cooling above ~2V
- Header to Temp Cont Board
- Jumper to disable cooling
- Temp Mon
- Enable/Disable Output
- Jumper to disable heating
- VSET protection circuit - disable heating below ~0.8V

## Power pins joined to a net without a drawn wire
VBAT: U$1.VBAT
VUSB: U$1.VUSB

## Library data of the parts
C1-C15 C20-C27 C30 = rlc-jqi:CAP: SMT Capacitor
C16-C19 = rcl:C-EU: CAPACITOR, European symbol
CP1 CP3 = rcl:CPOL-US: POLARIZED CAPACITOR, American symbol
CP2 = rcl:C-US: CAPACITOR, American symbol
D1-D4 = Lin-Temp-Controller:LED: Through-hole, side-view LED; DIGIKEY: 516-1417-ND
ENC1 ENC2 = connector-jqi:PEC09: PEC09-2320F-S0015 Rotary Encoder (Bourns).
IC1 IC2 IC7 IC9 = Lin-Temp-Controller:LM393: COMPARATOR; DIGIKEY: 296-1015-5-ND
IC3 = Lin-Temp-Controller:AD5624R: AD5624R Quad Output DAC w/internal Vref; DIGIKEY: AD5624RBRMZ-3-ND
IC4 IC5 IC8 IC10 = Lin-Temp-Controller:AD5262: AD5262 dual circuit digital pot; DIGIKEY: AD5262BRUZ200-ND
IC6 = Lin-Temp-Controller:TS6001: 2.5V Reference IC; DIGIKEY: TS6001BIG325TCT-ND
JP1 JP2 JP8 JP11 = pinhead:PINHD-2X6: PIN HEADER
JP3 JP5-JP7 JP9 JP10 JP12 JP13 = pinhead:PINHD-1X2: PIN HEADER
JP4 = Lin-Temp-Controller:SCRWTRM-1X2: Screw Terminal; DIGIKEY: ED2635-ND; MFR_PN: OSTTE020161
JP14 = pinhead:PINHD-2X2: PIN HEADER
L1-L4 = rlc-jqi:INDUCTOR: SMT Inductor.
LCD_HEADER = mcu-accessories:PINHD-2X4: PIN HEADER
R1-R5 R8-R15 R18 R19 R29-R32 R34-R40 R43-R49 R52-R58 R61-R67 R70-R76 R79-R85 R88-R90 = rlc-jqi:RES: SMT Resistor
R6 R7 R41 R42 R59 R60 R77 R78 = Lin-Temp-Controller:MODEL64_TRIMPOT; DIGIKEY: 987-1061-ND
R20-R28 R33 = jqi_passives:R_SMD
S1-S4 = Lin-Temp-Controller:SWITCH-DPDT: DPDT Switch; DIGIKEY: 100DP1T2B4M7QE-ND; MFR_PN: 100DP1T2B4M7QE
T1-T8 = Lin-Temp-Controller:MMBT3904: NPN TRANSISTOR; DIGIKEY: MMBT3904-FDICT-ND
TP1-TP27 = Lin-Temp-Controller:TESTPT
U$1 = mcu-accessories:TEENSY_3.1+4: Footprint for Teensy 3.1 board using all through-holes, i.e. the entire perimeter plus the 4 through-holes inboard (A10,A11,AREF, VUSB)
X1-X8 = connector-jqi:BNC: BNC Connector.; DIGIKEY: A32260-ND